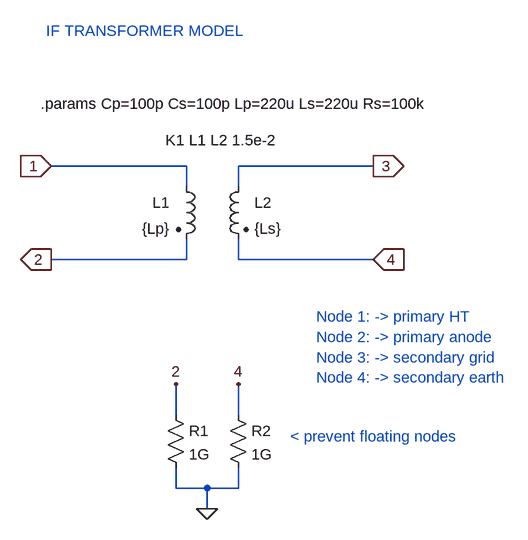
[diagram p0: schematic FM_IF_transformer_master.asc]
FM_IF_transformer_master.asc, the LTspice schematic file:
Version 4
SHEET 1 880 692
WIRE 128 96 -80 96
WIRE 416 96 208 96
WIRE 128 128 128 96
WIRE 208 128 208 96
WIRE 128 240 128 208
WIRE 128 240 -80 240
WIRE 208 240 208 208
WIRE 416 240 208 240
WIRE 112 480 112 432
WIRE 208 480 208 432
WIRE 112 592 112 560
WIRE 160 592 112 592
WIRE 208 592 208 560
WIRE 208 592 160 592
WIRE 160 624 160 592
FLAG 160 624 0
FLAG 112 432 2
FLAG 208 432 4
FLAG -80 96 1
IOPIN -80 96 In
FLAG -80 240 2
IOPIN -80 240 Out
FLAG 416 96 3
IOPIN 416 96 Out
FLAG 416 240 4
IOPIN 416 240 In
SYMBOL res 96 464 R0
SYMATTR InstName R1
SYMATTR Value 1G
SYMBOL res 192 464 R0
SYMATTR InstName R2
SYMATTR Value 1G
SYMBOL ind2 112 112 R0
WINDOW 0 -9 40 Right 0
WINDOW 3 -9 80 Right 0
SYMATTR InstName L1
SYMATTR Value {Lp}
SYMATTR Type ind
SYMATTR SpiceLine Rser=1 Rpar=100k Cpar={Cp}
SYMBOL ind2 224 112 M0
WINDOW 0 -9 40 Right 0
WINDOW 3 -9 80 Right 0
SYMATTR InstName L2
SYMATTR Value {Ls}
SYMATTR Type ind
SYMATTR SpiceLine Rser=1 Rpar={Rs} Cpar={Cs}
TEXT -88 -112 Left 0 ;IF TRANSFORMER MODEL
TEXT 328 328 Left 0 ;Node 1: -> primary HT\nNode 2: -> primary anode\nNode 3: -> secondary grid\nNode 4: -> secondary earth
TEXT 288 512 Left 0 ;< prevent floating nodes
TEXT 96 56 Left 0 !K1 L1 L2 1.5e-2
TEXT -96 0 Left 0 !.params Cp=100p Cs=100p Lp=220u Ls=220u Rs=100k

The netlist it stands for:
* FM_IF_transformer_master.asc
R1 2 0 1G
R2 4 0 1G
L1 1 2 {Lp} Rser=1 Rpar=100k Cpar={Cp}
L2 3 4 {Ls} Rser=1 Rpar={Rs} Cpar={Cs}
* IF TRANSFORMER MODEL
* Node 1: -> primary HT
* Node 2: -> primary anode
* Node 3: -> secondary grid
* Node 4: -> secondary earth
* < prevent floating nodes
K1 L1 L2 1.5e-2
.params Cp=100p Cs=100p Lp=220u Ls=220u Rs=100k
.backanno
.end